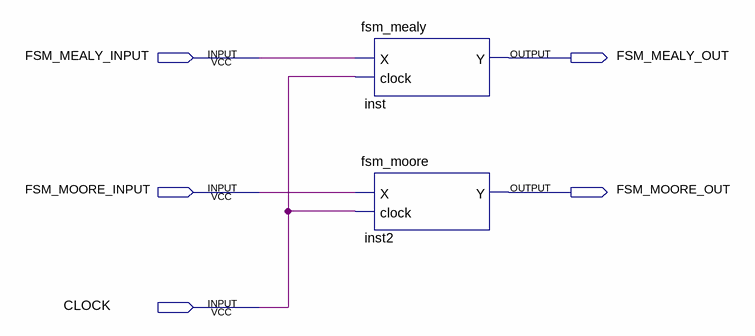
[diagram p0: schematic sheet]
// Quartus schematic fsm_top.bdf as structural Verilog: 2 symbols, 5 pins
module fsm_top (
  input  FSM_MEALY_INPUT,
  input  FSM_MOORE_INPUT,
  input  CLOCK,
  output FSM_MEALY_OUT,
  output FSM_MOORE_OUT
);

  fsm_mealy inst (.X(FSM_MEALY_INPUT), .clock(CLOCK), .Y(FSM_MEALY_OUT));
  fsm_moore inst2 (.X(FSM_MOORE_INPUT), .clock(CLOCK), .Y(FSM_MOORE_OUT));
endmodule
